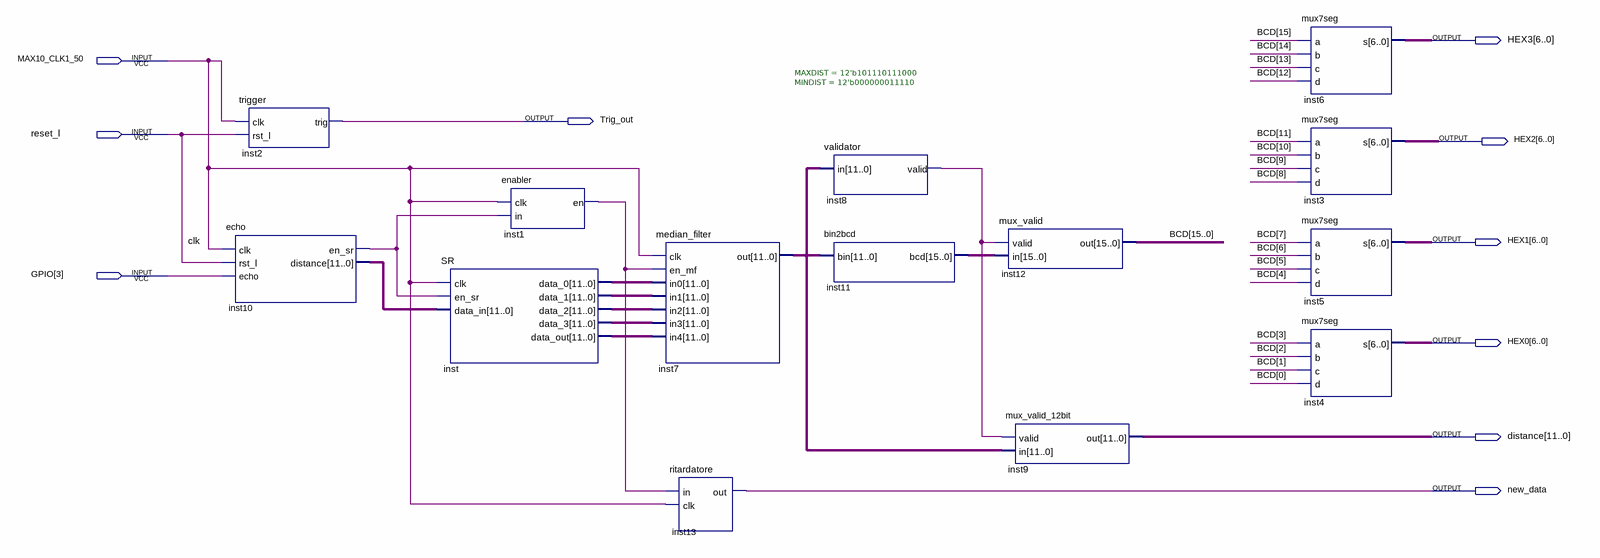
[diagram p0: schematic sheet]
// Quartus schematic sensor.bdf as structural Verilog: 14 symbols, 10 pins
module sensor (
  input  MAX10_CLK1_50,
  input  reset_l,
  input  [3:3] GPIO,
  output [6:0] HEX3,
  output Trig_out,
  output [6:0] HEX2,
  output [6:0] HEX1,
  output [6:0] HEX0,
  output [11:0] distance,
  output new_data
);

  wire inst1_en, inst8_valid, inst10_en_sr;
  wire [11:0] inst7_out, inst10_distance, inst_data_0, inst_data_1, inst_data_2, inst_data_3, inst_data_out;
  wire [15:0] BCD, inst11_bcd;

  trigger inst2 (.clk(MAX10_CLK1_50), .rst_l(reset_l), .trig(Trig_out));
  echo inst10 (.clk(MAX10_CLK1_50), .rst_l(reset_l), .echo(GPIO[3]), .en_sr(inst10_en_sr), .distance(inst10_distance));
  SR inst (
    .clk(MAX10_CLK1_50), .en_sr(inst10_en_sr), .data_in(inst10_distance), .data_0(inst_data_0),
    .data_1(inst_data_1), .data_2(inst_data_2), .data_3(inst_data_3), .data_out(inst_data_out));
  enabler inst1 (.clk(MAX10_CLK1_50), .in(inst10_en_sr), .en(inst1_en));
  median_filter inst7 (
    .clk(MAX10_CLK1_50), .en_mf(inst1_en), .in0(inst_data_0), .in1(inst_data_1), .in2(inst_data_2),
    .in3(inst_data_3), .in4(inst_data_out), .out(inst7_out));
  ritardatore inst13 (.in(inst1_en), .clk(MAX10_CLK1_50), .out(new_data));
  validator #(.MAXDIST(12'b101110111000), .MINDIST(12'b000000011110)) inst8 (.in(inst7_out), .valid(inst8_valid));
  bin2bcd inst11 (.bin(inst7_out), .bcd(inst11_bcd));
  mux_valid inst12 (.valid(inst8_valid), .in(inst11_bcd), .out(BCD));
  mux_valid_12bit inst9 (.valid(inst8_valid), .in(inst7_out), .out(distance));
  mux7seg inst6 (.a(BCD[15]), .b(BCD[14]), .c(BCD[13]), .d(BCD[12]), .s(HEX3));
  mux7seg inst3 (.a(BCD[11]), .b(BCD[10]), .c(BCD[9]), .d(BCD[8]), .s(HEX2));
  mux7seg inst5 (.a(BCD[7]), .b(BCD[6]), .c(BCD[5]), .d(BCD[4]), .s(HEX1));
  mux7seg inst4 (.a(BCD[3]), .b(BCD[2]), .c(BCD[1]), .d(BCD[0]), .s(HEX0));

  // Other names for the same wires on the sheet: clk = MAX10_CLK1_50
endmodule
